# Altium project Cherry_Mx_ByZ.PrjPcb
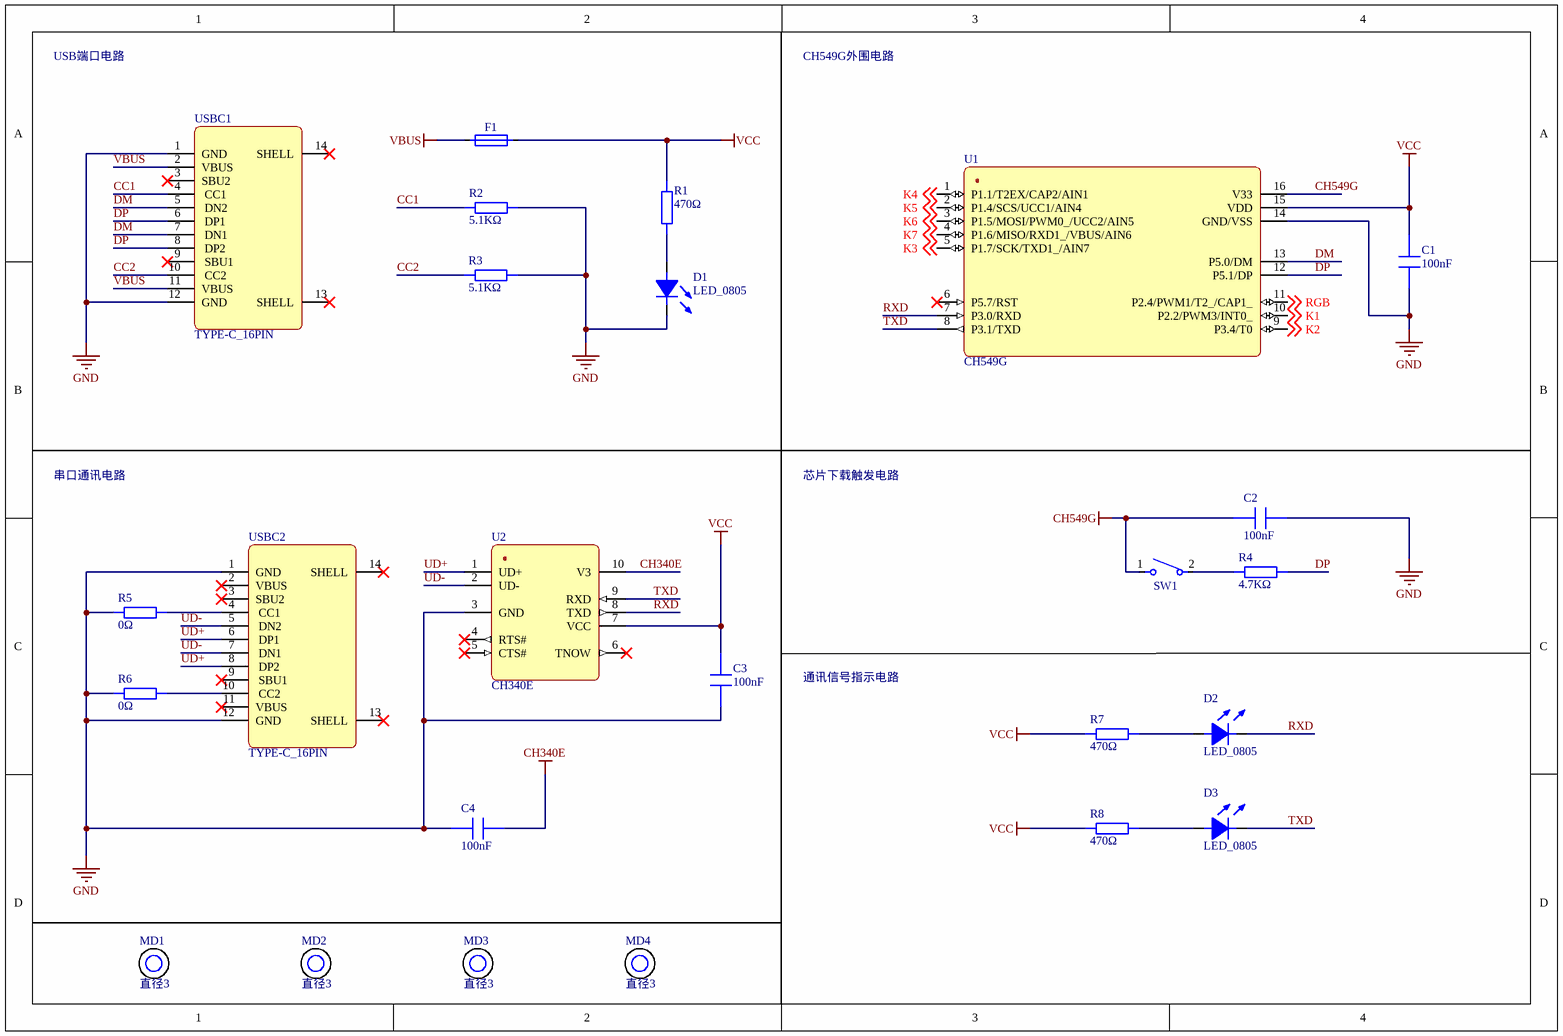
[diagram p0: Cherry_Mx_ByZ.SchDoc]
Author: XiaoxiaoZhouCoder
2 sheets, 41 parts. Net scope: global (net labels, ports and power ports of the same name join across sheets).
Board file: Cherry_Mx_ByZ.PcbDoc
Sheets:
  Cherry_Mx_ByZ.SchDoc
  Switch_RGB_Cherry.SchDoc

## Sheet Cherry_Mx_ByZ.SchDoc
size A4; SheetNumber: 1; SheetTotal: 2

### Parts
C1  100nF  [SM_C_0805]
C2  100nF  [SM_C_0805]
C3  100nF  [SM_C_0805]
C4  100nF  [SM_C_0805]
D1  LED_0805  [LED_0805_White]
D2  LED_0805  [LED_0805_White]
D3  LED_0805  [LED_0805_White]
F1  F_0805  [SMD_F_0805]  (value not drawn)
MD1  value 直径3  [M3]  (hidden comment: M3)
MD2  value 直径3  [M3]  (hidden comment: M3)
MD3  value 直径3  [M3]  (hidden comment: M3)
MD4  value 直径3  [M3]  (hidden comment: M3)
R1  470Ω  [SM_R_0805]
R2  5.1KΩ  [SM_R_0805]
R3  5.1KΩ  [SM_R_0805]
R4  4.7KΩ  [SM_R_0805]
R5  0Ω  [SM_R_0805]
R6  0Ω  [SM_R_0805]
R7  470Ω  [SM_R_0805]
R8  470Ω  [SM_R_0805]
SW1  轻触开关  [SW_L6W3.5]  (value not drawn)
U1  CH549G  [SOP-16]
U2  CH340E  [MSOP-10]
USBC1  TYPE-C_16PIN  [SMD_TYPE-C_16PIN_WS]
USBC2  TYPE-C_16PIN  [SMD_TYPE-C_16PIN_WS]

### Nets
CH340E: C4.1 U2.10(V3)
CH549G: C2.2 SW1.1 U1.16(V33)
GND: C1.1 C2.1 C3.1 C4.2 D1.2 R2.2 R3.2 R5.1 R6.1 U1.14(GND/VSS) U2.3(GND) USBC1.1(GND) USBC1.12(GND) USBC2.1(GND) USBC2.12(GND)
VBUS: F1.1 USBC1.2(VBUS) USBC1.11(VBUS)
VCC: C1.2 C3.2 F1.2 R1.1 R7.1 R8.1 U1.15(VDD) U2.7(VCC)
CC1: R2.1 USBC1.4(CC1)
CC2: R3.1 USBC1.10(CC2)
DM: U1.13(P5.0/DM) USBC1.5(DN2) USBC1.7(DN1)
DP: R4.2 U1.12(P5.1/DP) USBC1.6(DP1) USBC1.8(DP2)
K1: U1.10(P2.2/PWM3/INT0_) ; off-sheet K1
K2: U1.9(P3.4/T0) ; off-sheet K2
K3: U1.5(P1.7/SCK/TXD1_/AIN7) ; off-sheet K3
K4: U1.1(P1.1/T2EX/CAP2/AIN1) ; off-sheet K4
K5: U1.2(P1.4/SCS/UCC1/AIN4) ; off-sheet K5
K6: U1.3(P1.5/MOSI/PWM0_/UCC2/AIN5) ; off-sheet K6
K7: U1.4(P1.6/MISO/RXD1_/VBUS/AIN6) ; off-sheet K7
RGB: U1.11(P2.4/PWM1/T2_/CAP1_) ; off-sheet RGB
RXD: D2.2 U1.7(P3.0/RXD) U2.8(TXD)
TXD: D3.2 U1.8(P3.1/TXD) U2.9(RXD)
UD+: U2.1(UD+) USBC2.6(DP1) USBC2.8(DP2)
UD-: U2.2(UD-) USBC2.5(DN2) USBC2.7(DN1)
NetD1_1: D1.1 R1.2
NetD2_1: D2.1 R7.2
NetD3_1: D3.1 R8.2
NetR4_1: R4.1 SW1.2
NetR5_2: R5.2 USBC2.4(CC1)
NetR6_2: R6.2 USBC2.10(CC2)

Not connected (* = marked no-connect by the designer): U1 6(P5.7/RST)*; U2 4(RTS#)* 5(CTS#)* 6(TNOW)*; USBC1 3(SBU2)* 9(_SBU1)* 13(SHELL)* 14(SHELL)*; USBC2 2(VBUS)* 3(SBU2)* 9(_SBU1)* 11(VBUS)* 13(SHELL)* 14(SHELL)*

### Notes on the sheet
- USB端口电路
- CH549G外围电路
- 串口通讯电路
- 芯片下载触发电路
- 通讯信号指示电路

### Library data of the parts
C1-C4 = C0805: 贴片电容
D1-D3 = LED_0805: 发光二极管
F1 = F_0805: 自恢复保险丝; 最大电压: 6V; 最大电流: 100A; 保持电流: 500mA; 跳闸电流: 1A; 初态阻值: 150mΩ; 动作时间: MAX_100ms; 品　　牌: 君耀电子; 厂家型号: SMD0805B050TF; ComponentLink1Description: 立创商城; ComponentLink1URL: https://item.szlcsc.com/258562.html; 立创编号: C269104
MD1-MD4 = M3: 直径3mm过孔
R1-R8 = R0805: 贴片电阻
SW1 = 轻触开关: 按钮轻触开关
U1 = CH549G: 沁恒USB芯片; ComponentLink1Description: 南京沁恒; ComponentLink1URL: https://www.wch.cn/downloads/CH549DS1_PDF.html
U2 = CH340E: 沁恒串口转TTL; ComponentLink1Description: 立创商城; ComponentLink1URL: https://item.szlcsc.com/100866.html
USBC1 USBC2 = TYPE-C_16PIN: USB连接器; 额定电流: 5A; 安装方式: 卧贴; 接口类型: 母座; 触点数量: 16; 品　　牌: SHOU HAN; 厂家型号: TYPE-C 16PIN 2MD(073); 立创编号: C2765186; ComponentLink1Description: 立创商城; ComponentLink1URL: https://item.szlcsc.com/2901843.html

## Sheet Switch_RGB_Cherry.SchDoc
size A4; SheetNumber: 2; SheetTotal: 2
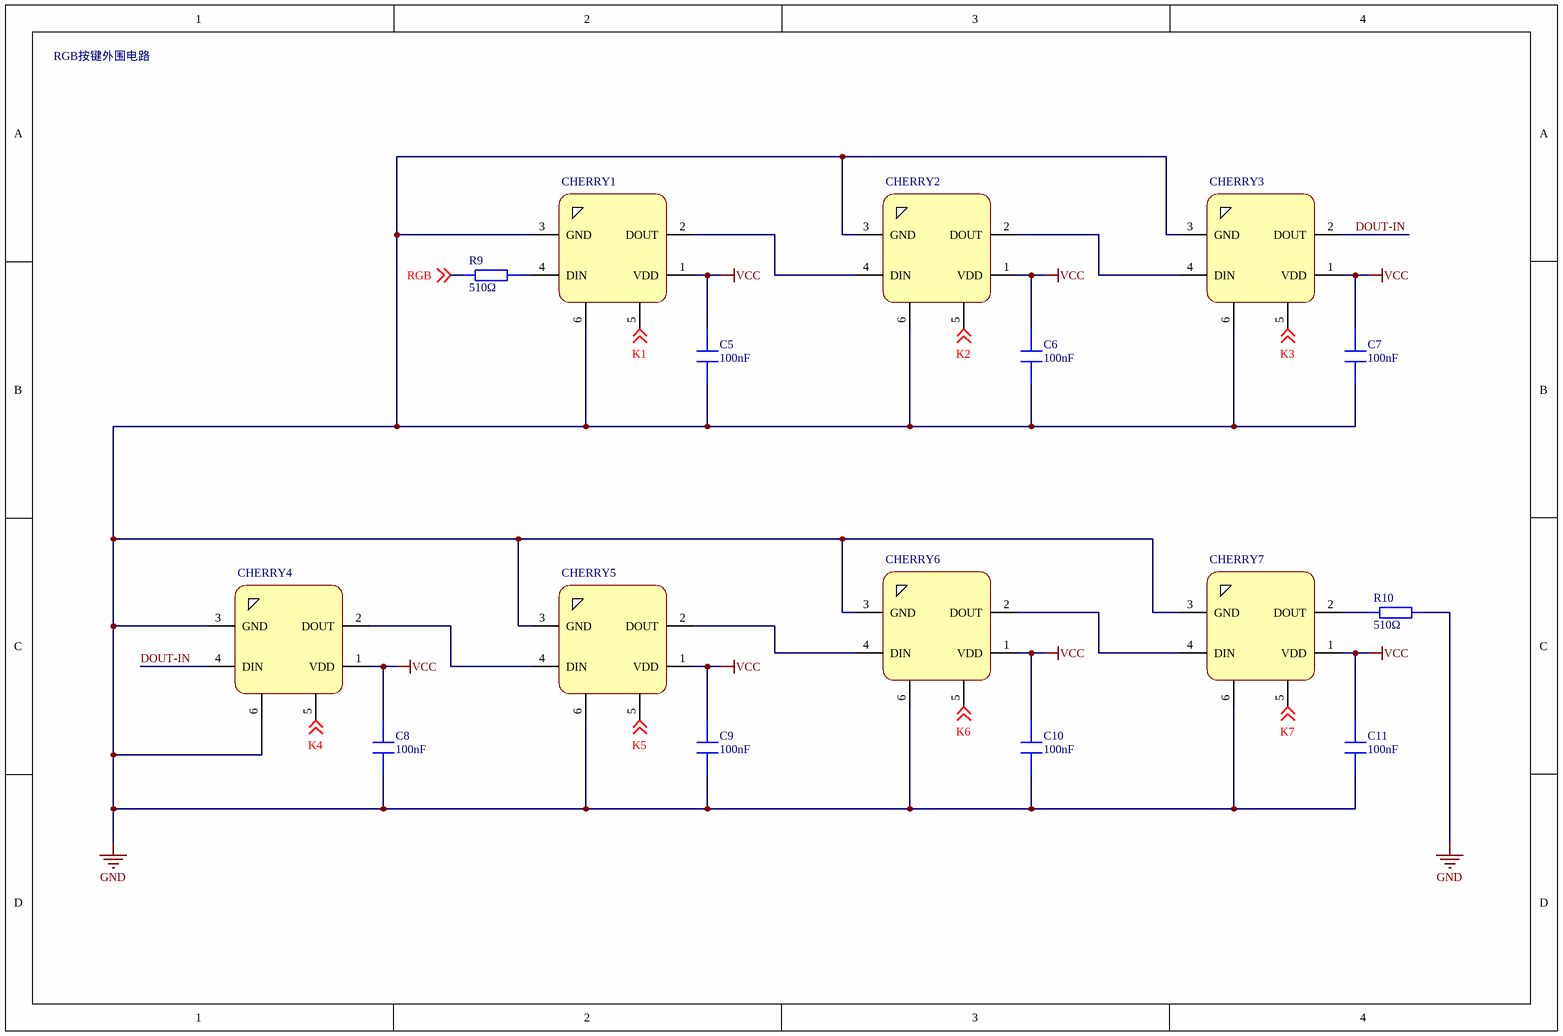
[diagram p1: Switch_RGB_Cherry.SchDoc]

### Parts
C5  100nF  [SM_C_0805]
C6  100nF  [SM_C_0805]
C7  100nF  [SM_C_0805]
C8  100nF  [SM_C_0805]
C9  100nF  [SM_C_0805]
C10  100nF  [SM_C_0805]
C11  100nF  [SM_C_0805]
CHERRY1  Cherry_RGB  [Cherry]  (value not drawn)
CHERRY2  Cherry_RGB  [Cherry]  (value not drawn)
CHERRY3  Cherry_RGB  [Cherry]  (value not drawn)
CHERRY4  Cherry_RGB  [Cherry]  (value not drawn)
CHERRY5  Cherry_RGB  [Cherry]  (value not drawn)
CHERRY6  Cherry_RGB  [Cherry]  (value not drawn)
CHERRY7  Cherry_RGB  [Cherry]  (value not drawn)
R9  510Ω  [SM_R_0805]
R10  510Ω  [SM_R_0805]

### Nets
GND: C5.1 C6.1 C7.1 C8.1 C9.1 C10.1 C11.1 CHERRY1.3(GND) CHERRY1.6(KI) CHERRY2.3(GND) CHERRY2.6(KI) CHERRY3.3(GND) CHERRY3.6(KI) CHERRY4.3(GND) CHERRY4.6(KI) CHERRY5.3(GND) CHERRY5.6(KI) CHERRY6.3(GND) CHERRY6.6(KI) CHERRY7.3(GND) CHERRY7.6(KI) R10.2
VCC: C5.2 C6.2 C7.2 C8.2 C9.2 C10.2 C11.2 CHERRY1.1(VDD) CHERRY2.1(VDD) CHERRY3.1(VDD) CHERRY4.1(VDD) CHERRY5.1(VDD) CHERRY6.1(VDD) CHERRY7.1(VDD)
DOUT-IN: CHERRY3.2(DOUT) CHERRY4.4(DIN)
K1: CHERRY1.5(KO) ; off-sheet K1
K2: CHERRY2.5(KO) ; off-sheet K2
K3: CHERRY3.5(KO) ; off-sheet K3
K4: CHERRY4.5(KO) ; off-sheet K4
K5: CHERRY5.5(KO) ; off-sheet K5
K6: CHERRY6.5(KO) ; off-sheet K6
K7: CHERRY7.5(KO) ; off-sheet K7
RGB: R9.1 ; off-sheet RGB
NetCHERRY1_2: CHERRY1.2(DOUT) CHERRY2.4(DIN)
NetCHERRY1_4: CHERRY1.4(DIN) R9.2
NetCHERRY2_2: CHERRY2.2(DOUT) CHERRY3.4(DIN)
NetCHERRY4_2: CHERRY4.2(DOUT) CHERRY5.4(DIN)
NetCHERRY5_2: CHERRY5.2(DOUT) CHERRY6.4(DIN)
NetCHERRY6_2: CHERRY6.2(DOUT) CHERRY7.4(DIN)
NetCHERRY7_2: CHERRY7.2(DOUT) R10.1

### Notes on the sheet
- RGB按键外围电路

### Library data of the parts
C5-C11 = C0805: 贴片电容
CHERRY1-CHERRY7 = Cherry_RGB: 樱花轴CHERRY
R9 R10 = R0805: 贴片电阻

## Nets that join several sheets
GND: Cherry_Mx_ByZ (15 pins), Switch_RGB_Cherry (22 pins)
VCC: Cherry_Mx_ByZ (8 pins), Switch_RGB_Cherry (14 pins)
K1: Cherry_Mx_ByZ (U1.10), Switch_RGB_Cherry (CHERRY1.5)
K2: Cherry_Mx_ByZ (U1.9), Switch_RGB_Cherry (CHERRY2.5)
K3: Cherry_Mx_ByZ (U1.5), Switch_RGB_Cherry (CHERRY3.5)
K4: Cherry_Mx_ByZ (U1.1), Switch_RGB_Cherry (CHERRY4.5)
K5: Cherry_Mx_ByZ (U1.2), Switch_RGB_Cherry (CHERRY5.5)
K6: Cherry_Mx_ByZ (U1.3), Switch_RGB_Cherry (CHERRY6.5)
K7: Cherry_Mx_ByZ (U1.4), Switch_RGB_Cherry (CHERRY7.5)
RGB: Cherry_Mx_ByZ (U1.11), Switch_RGB_Cherry (R9.1)